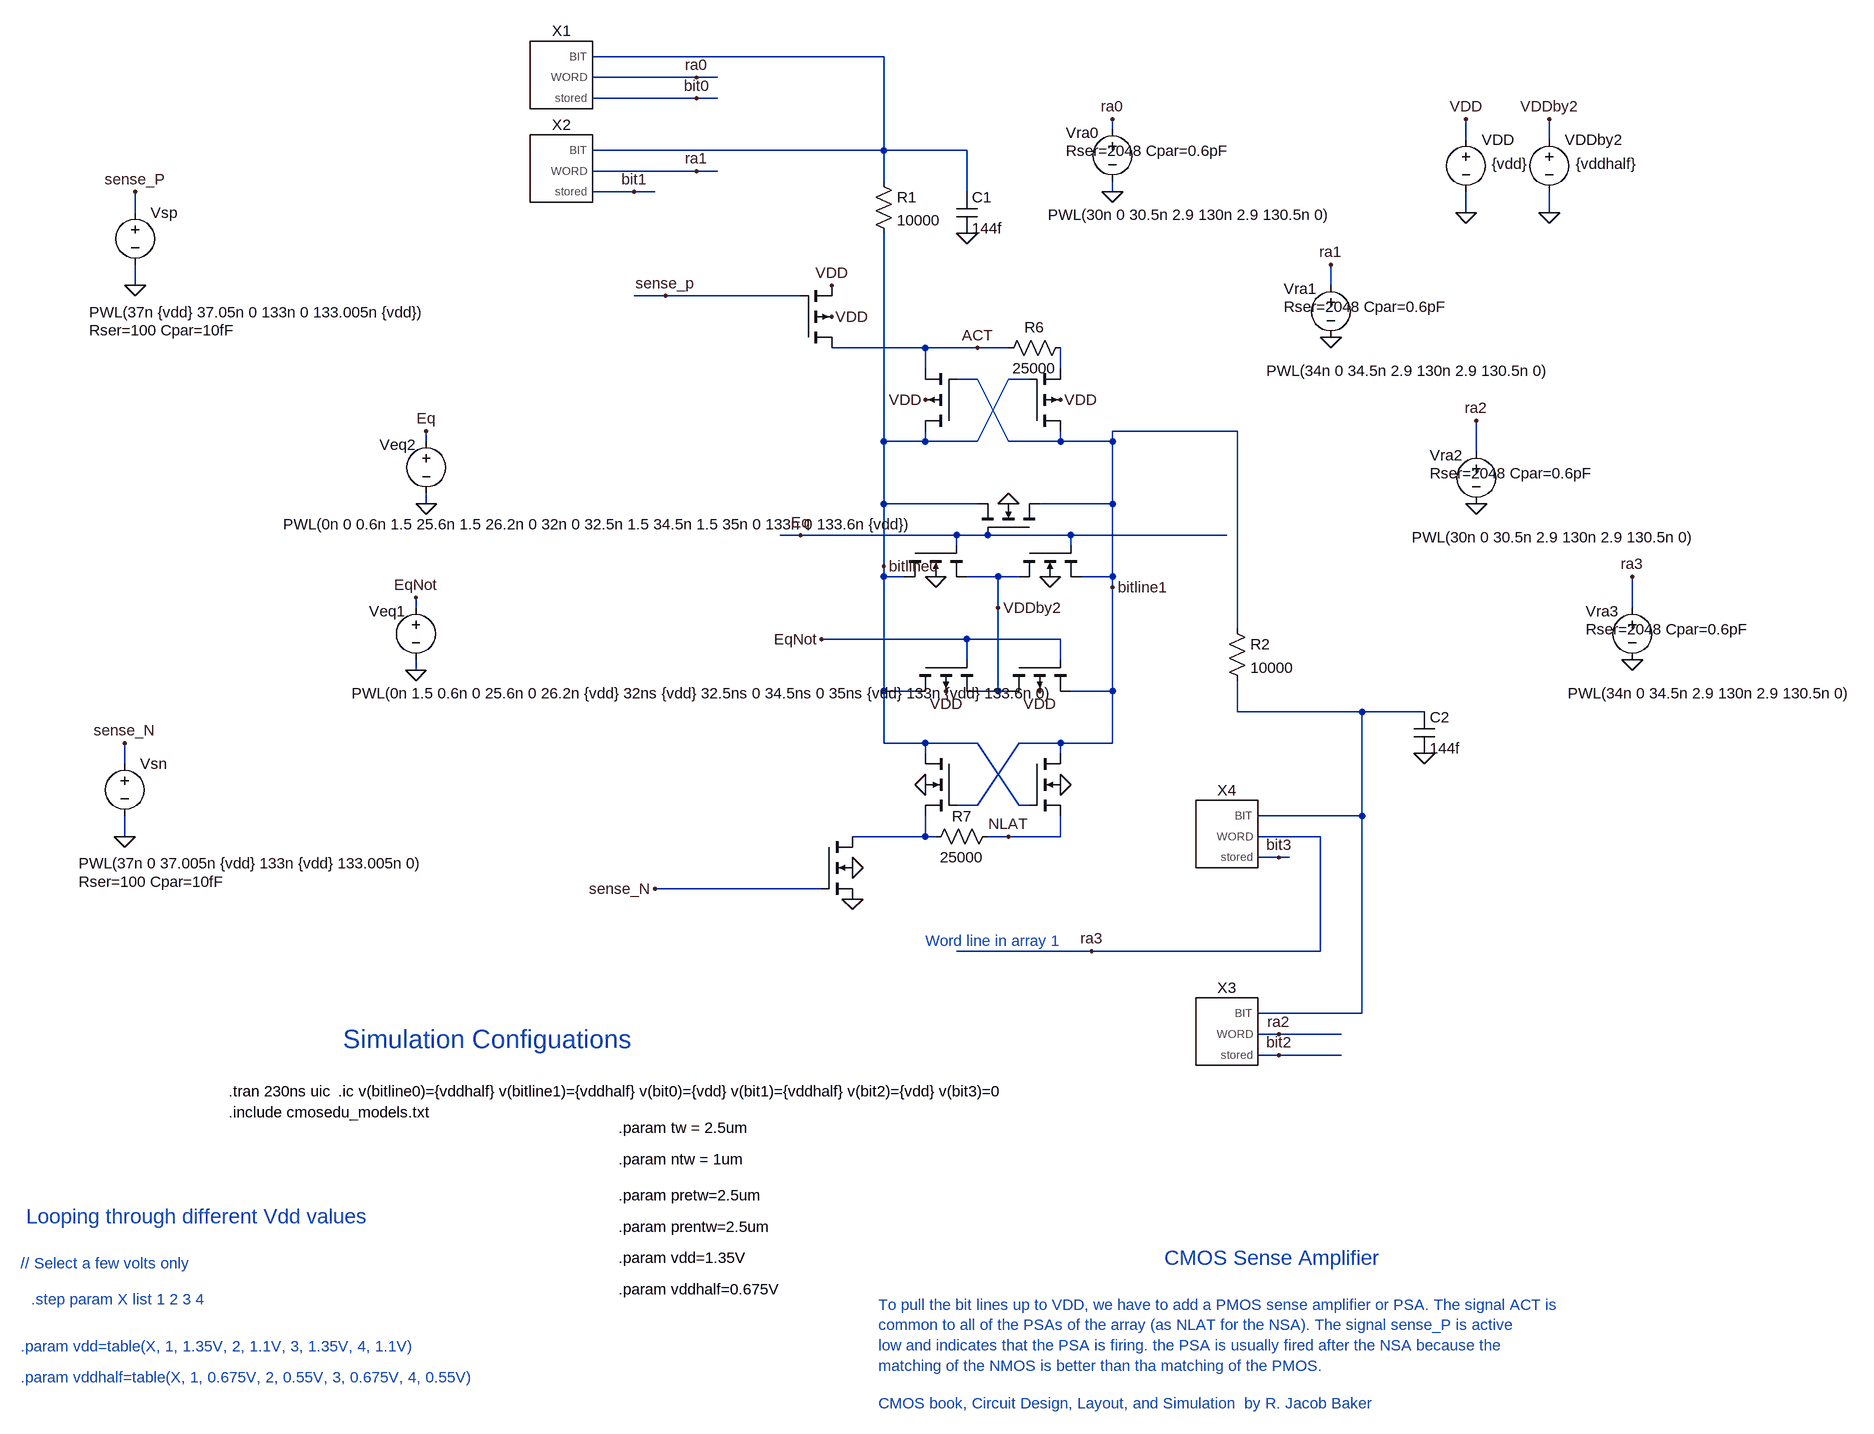
[diagram p0: schematic top_level.asc]
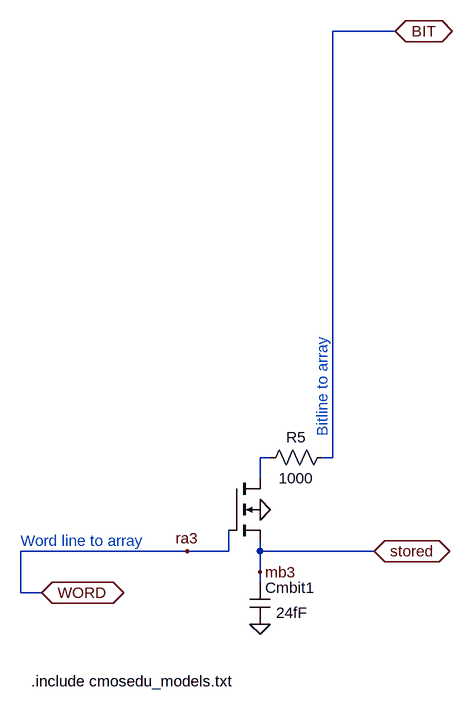
[diagram p1: sub-circuit dram_cell.asc]
top_level.asc, the LTspice schematic file:
Version 4
SHEET 1 2296 1352
WIRE 768 -1104 320 -1104
WIRE 480 -1072 320 -1072
WIRE 512 -1072 480 -1072
WIRE 480 -1040 320 -1040
WIRE 512 -1040 480 -1040
WIRE 1120 -992 1120 -1008
WIRE 1664 -976 1664 -1008
WIRE 1792 -976 1792 -1008
WIRE 768 -960 768 -1104
WIRE 768 -960 320 -960
WIRE 896 -960 768 -960
WIRE 480 -928 320 -928
WIRE 512 -928 480 -928
WIRE 768 -912 768 -960
WIRE 384 -896 320 -896
WIRE 416 -896 384 -896
WIRE 896 -896 896 -960
WIRE 1120 -896 1120 -912
WIRE -384 -864 -384 -896
WIRE 1664 -864 1664 -896
WIRE 1792 -864 1792 -896
WIRE -384 -752 -384 -784
WIRE 1456 -752 1456 -784
WIRE 432 -736 384 -736
WIRE 640 -736 432 -736
WIRE 832 -656 688 -656
WIRE 912 -656 832 -656
WIRE 960 -656 912 -656
WIRE 832 -624 832 -656
WIRE 1040 -624 1040 -656
WIRE 912 -608 880 -608
WIRE 992 -608 960 -608
WIRE 1312 -528 1120 -528
WIRE 64 -512 64 -528
WIRE 768 -512 768 -832
WIRE 832 -512 832 -528
WIRE 832 -512 768 -512
WIRE 912 -512 960 -608
WIRE 912 -512 832 -512
WIRE 960 -512 912 -608
WIRE 1040 -512 1040 -528
WIRE 1040 -512 960 -512
WIRE 1120 -512 1120 -528
WIRE 1120 -512 1040 -512
WIRE 1680 -496 1680 -544
WIRE 64 -416 64 -432
WIRE 768 -416 768 -512
WIRE 912 -416 768 -416
WIRE 1120 -416 1120 -512
WIRE 1120 -416 1008 -416
WIRE 640 -368 608 -368
WIRE 880 -368 640 -368
WIRE 928 -368 880 -368
WIRE 1056 -368 928 -368
WIRE 1296 -368 1056 -368
WIRE 880 -352 880 -368
WIRE 1056 -352 1056 -368
WIRE 768 -320 768 -416
WIRE 768 -304 768 -320
WIRE 800 -304 768 -304
WIRE 944 -304 896 -304
WIRE 976 -304 944 -304
WIRE 1120 -304 1120 -416
WIRE 1120 -304 1072 -304
WIRE 1120 -288 1120 -304
WIRE 48 -256 48 -272
WIRE 944 -256 944 -304
WIRE 1920 -256 1920 -304
WIRE 1312 -224 1312 -528
WIRE 896 -208 672 -208
WIRE 1040 -208 896 -208
WIRE 896 -176 896 -208
WIRE 1040 -176 1040 -208
WIRE 48 -160 48 -176
WIRE 768 -128 768 -304
WIRE 816 -128 768 -128
WIRE 944 -128 944 -256
WIRE 944 -128 912 -128
WIRE 960 -128 944 -128
WIRE 1120 -128 1120 -288
WIRE 1120 -128 1056 -128
WIRE 1312 -96 1312 -144
WIRE 1504 -96 1312 -96
WIRE 1600 -96 1504 -96
WIRE 768 -48 768 -128
WIRE 832 -48 768 -48
WIRE 912 -48 832 -48
WIRE 1040 -48 976 -48
WIRE 1120 -48 1120 -128
WIRE 1120 -48 1040 -48
WIRE 832 -32 832 -48
WIRE 1040 -32 1040 -48
WIRE -400 -16 -400 -48
WIRE 912 48 976 -48
WIRE 912 48 880 48
WIRE 976 48 912 -48
WIRE 992 48 976 48
WIRE 1504 64 1504 -96
WIRE 1504 64 1344 64
WIRE -400 96 -400 64
WIRE 832 96 832 64
WIRE 832 96 720 96
WIRE 848 96 832 96
WIRE 960 96 928 96
WIRE 1040 96 1040 64
WIRE 1040 96 960 96
WIRE 1440 96 1344 96
WIRE 1376 128 1344 128
WIRE 1392 128 1376 128
WIRE 672 176 416 176
WIRE 1088 272 880 272
WIRE 1440 272 1440 96
WIRE 1440 272 1088 272
WIRE 1504 368 1504 64
WIRE 1504 368 1344 368
WIRE 1376 400 1344 400
WIRE 1472 400 1376 400
WIRE 1376 432 1344 432
WIRE 1472 432 1376 432
FLAG 720 144 0
FLAG 1664 -864 0
FLAG 1664 -1008 VDD
FLAG 1792 -864 0
FLAG 1792 -1008 VDDby2
FLAG -384 -752 0
FLAG -384 -896 sense_P
FLAG 1040 16 0
FLAG 832 16 0
FLAG 960 -416 0
FLAG 848 -304 0
FLAG 1024 -304 0
FLAG 640 -368 Eq
FLAG 944 -256 VDDby2
FLAG 416 176 sense_N
FLAG 720 192 0
FLAG 768 -320 bitline0
FLAG 1120 -288 bitline1
FLAG 1088 272 ra3
FLAG 1120 -896 0
FLAG 1120 -1008 ra0
FLAG 688 -704 VDD
FLAG 1040 -576 VDD
FLAG 832 -576 VDD
FLAG 688 -752 VDD
FLAG 432 -736 sense_p
FLAG 912 -656 ACT
FLAG 960 96 NLAT
FLAG -400 96 0
FLAG -400 -48 sense_N
FLAG 672 -208 EqNot
FLAG 864 -128 VDD
FLAG 1008 -128 VDD
FLAG 48 -160 0
FLAG 48 -272 EqNot
FLAG 64 -416 0
FLAG 64 -528 Eq
FLAG 480 -1072 ra0
FLAG 480 -1040 bit0
FLAG 384 -896 bit1
FLAG 480 -928 ra1
FLAG 1376 400 ra2
FLAG 1376 432 bit2
FLAG 1376 128 bit3
FLAG 896 -832 0
FLAG 1600 -32 0
FLAG 1456 -784 ra1
FLAG 1456 -672 0
FLAG 1680 -416 0
FLAG 1920 -176 0
FLAG 1680 -544 ra2
FLAG 1920 -304 ra3
SYMBOL nmos4 672 96 R0
WINDOW 0 104 24 Invisible 2
WINDOW 3 179 41 Invisible 2
SYMATTR InstName M1
SYMATTR Value nmos45lp
SYMATTR Value2 l=0.27um w=0.22um
SYMBOL voltage 1664 -992 R0
WINDOW 123 0 0 Left 2
WINDOW 39 0 0 Left 2
WINDOW 3 40 53 Left 2
SYMATTR Value {vdd}
SYMATTR InstName VDD
SYMBOL voltage 1792 -992 R0
WINDOW 123 0 0 Left 2
WINDOW 39 0 0 Left 2
WINDOW 3 41 53 Left 2
SYMATTR Value {vddhalf}
SYMATTR InstName VDDby2
SYMBOL voltage -384 -880 R0
WINDOW 123 0 0 Left 2
WINDOW 39 -71 197 Left 2
WINDOW 3 -71 169 Left 2
SYMATTR SpiceLine Rser=100 Cpar=10fF
SYMATTR Value PWL(37n {vdd} 37.05n 0 133n 0 133.005n {vdd})
SYMATTR InstName Vsp
SYMBOL nmos4 992 -32 R0
WINDOW 0 104 24 Invisible 2
WINDOW 3 179 41 Invisible 2
SYMATTR InstName M2
SYMATTR Value nmos45hp
SYMATTR Value2 l=0.16um w={ntw}
SYMBOL nmos4 880 -32 M0
WINDOW 0 104 24 Invisible 2
WINDOW 3 179 41 Invisible 2
SYMATTR InstName M3
SYMATTR Value nmos45hp
SYMATTR Value2 l=0.16um w={ntw}
SYMBOL nmos4 1008 -368 M270
WINDOW 0 104 24 Invisible 2
WINDOW 3 179 41 Invisible 2
SYMATTR InstName M4
SYMATTR Value nmos45hp
SYMATTR Value2 l=0.16um w={prentw}
SYMBOL nmos4 800 -352 M90
WINDOW 0 104 24 Invisible 2
WINDOW 3 179 41 Invisible 2
SYMATTR InstName M5
SYMATTR Value nmos45hp
SYMATTR Value2 l=0.16um w={prentw}
SYMBOL nmos4 976 -352 M90
WINDOW 0 104 24 Invisible 2
WINDOW 3 179 41 Invisible 2
SYMATTR InstName M6
SYMATTR Value nmos45hp
SYMATTR Value2 l=0.16um w={prentw}
SYMBOL voltage 1120 -1008 R0
WINDOW 0 -72 21 Left 2
WINDOW 3 -99 147 Left 2
WINDOW 123 0 0 Left 2
WINDOW 39 -72 49 Left 2
SYMATTR InstName Vra0
SYMATTR Value PWL(30n 0 30.5n 2.9 130n 2.9 130.5n 0)
SYMATTR SpiceLine Rser=2048 Cpar=0.6pF
SYMBOL pmos4 640 -656 M180
WINDOW 0 56 32 Invisible 2
WINDOW 3 56 72 Invisible 2
SYMATTR InstName M9
SYMATTR Value pmos45lp
SYMATTR Value2 l=0.27um w=0.22um
SYMBOL pmos4 992 -528 M180
WINDOW 0 56 32 Invisible 2
WINDOW 3 56 72 Invisible 2
SYMATTR InstName M10
SYMATTR Value pmos45hp
SYMATTR Value2 l=0.16um w={tw}
SYMBOL pmos4 880 -528 R180
WINDOW 0 56 32 Invisible 2
WINDOW 3 56 72 Invisible 2
SYMATTR InstName M11
SYMATTR Value pmos45hp
SYMATTR Value2 l=0.16um w={tw}
SYMBOL voltage -400 -32 R0
WINDOW 123 0 0 Left 2
WINDOW 39 -71 197 Left 2
WINDOW 3 -71 169 Left 2
SYMATTR SpiceLine Rser=100 Cpar=10fF
SYMATTR Value PWL(37n 0 37.005n {vdd} 133n {vdd} 133.005n 0)
SYMATTR InstName Vsn
SYMBOL res 1056 -672 R90
WINDOW 0 0 56 VBottom 2
WINDOW 3 32 56 VTop 2
SYMATTR InstName R6
SYMATTR Value 25000
SYMBOL res 944 80 R90
WINDOW 0 0 56 VBottom 2
WINDOW 3 32 56 VTop 2
SYMATTR InstName R7
SYMATTR Value 25000
SYMBOL pmos4 816 -176 M90
WINDOW 0 56 32 Invisible 2
WINDOW 3 56 72 Invisible 2
SYMATTR InstName M12
SYMATTR Value pmos45hp
SYMATTR Value2 l=0.16um w={pretw}
SYMBOL pmos4 960 -176 M90
WINDOW 0 56 32 Invisible 2
WINDOW 3 56 72 Invisible 2
SYMATTR InstName M13
SYMATTR Value pmos45hp
SYMATTR Value2 l=0.16um w={pretw}
SYMBOL voltage 48 -272 R0
WINDOW 0 -72 21 Left 2
WINDOW 3 -99 147 Left 2
WINDOW 123 0 0 Left 2
WINDOW 39 0 0 Left 2
SYMATTR InstName Veq1
SYMATTR Value PWL(0n 1.5 0.6n 0 25.6n 0 26.2n {vdd} 32ns {vdd} 32.5ns 0 34.5ns 0 35ns {vdd} 133n {vdd} 133.6n 0)
SYMBOL voltage 64 -528 R0
WINDOW 0 -72 21 Left 2
WINDOW 3 -220 143 Left 2
WINDOW 123 0 0 Left 2
WINDOW 39 0 0 Left 2
SYMATTR InstName Veq2
SYMATTR Value PWL(0n 0 0.6n 1.5 25.6n 1.5 26.2n 0 32n 0 32.5n 1.5 34.5n 1.5 35n 0 133n 0 133.6n {vdd})
SYMBOL DRAM_cell 272 -1088 R0
SYMATTR InstName X1
SYMBOL DRAM_cell 1296 80 R0
SYMATTR InstName X4
SYMBOL DRAM_cell 272 -944 R0
SYMATTR InstName X2
SYMBOL DRAM_cell 1296 384 R0
SYMATTR InstName X3
SYMBOL res 752 -928 R0
SYMATTR InstName R1
SYMATTR Value 10000
SYMBOL cap 880 -896 R0
SYMATTR InstName C1
SYMATTR Value 144f
SYMBOL res 1296 -240 R0
SYMATTR InstName R2
SYMATTR Value 10000
SYMBOL cap 1584 -96 R0
SYMATTR InstName C2
SYMATTR Value 144f
SYMBOL voltage 1456 -768 R0
WINDOW 0 -72 21 Left 2
WINDOW 3 -99 147 Left 2
WINDOW 123 0 0 Left 2
WINDOW 39 -72 49 Left 2
SYMATTR InstName Vra1
SYMATTR Value PWL(34n 0 34.5n 2.9 130n 2.9 130.5n 0)
SYMATTR SpiceLine Rser=2048 Cpar=0.6pF
SYMBOL voltage 1680 -512 R0
WINDOW 0 -72 21 Left 2
WINDOW 3 -99 147 Left 2
WINDOW 123 0 0 Left 2
WINDOW 39 -72 49 Left 2
SYMATTR InstName Vra2
SYMATTR Value PWL(30n 0 30.5n 2.9 130n 2.9 130.5n 0)
SYMATTR SpiceLine Rser=2048 Cpar=0.6pF
SYMBOL voltage 1920 -272 R0
WINDOW 0 -72 21 Left 2
WINDOW 3 -99 147 Left 2
WINDOW 123 0 0 Left 2
WINDOW 39 -72 49 Left 2
SYMATTR InstName Vra3
SYMATTR Value PWL(34n 0 34.5n 2.9 130n 2.9 130.5n 0)
SYMATTR SpiceLine Rser=2048 Cpar=0.6pF
TEXT -240 520 Left 2 !.include cmosedu_models.txt
TEXT -72 488 Left 2 !.ic v(bitline0)={vddhalf} v(bitline1)={vddhalf} v(bit0)={vdd} v(bit1)={vddhalf} v(bit2)={vdd} v(bit3)=0
TEXT -240 488 Left 2 !.tran 230ns uic
TEXT 832 256 Left 2 ;Word line in array 1
TEXT 1200 744 Left 3 ;CMOS Sense Amplifier
TEXT 760 816 Left 2 ;To pull the bit lines up to VDD, we have to add a PMOS sense amplifier or PSA. The signal ACT is\ncommon to all of the PSAs of the array (as NLAT for the NSA). The signal sense_P is active\nlow and indicates that the PSA is firing. the PSA is usually fired after the NSA because the \nmatching of the NMOS is better than tha matching of the PMOS.
TEXT 760 968 Left 2 ;CMOS book, Circuit Design, Layout, and Simulation  by R. Jacob Baker
TEXT -64 408 Left 4 ;Simulation Configuations
TEXT -552 680 Left 3 ;Looping through different Vdd values
TEXT -544 808 Left 2 ;.step param X list 1 2 3 4
TEXT -560 752 Left 2 ;// Select a few volts only
TEXT -560 880 Left 2 ;.param vdd=table(X, 1, 1.35V, 2, 1.1V, 3, 1.35V, 4, 1.1V)
TEXT -560 928 Left 2 ;.param vddhalf=table(X, 1, 0.675V, 2, 0.55V, 3, 0.675V, 4, 0.55V)
TEXT 360 544 Left 2 !.param tw = 2.5um
TEXT 360 592 Left 2 !.param ntw = 1um
TEXT 360 648 Left 2 !.param pretw=2.5um
TEXT 360 696 Left 2 !.param prentw=2.5um
TEXT 360 744 Left 2 !.param vdd=1.35V
TEXT 360 792 Left 2 !.param vddhalf=0.675V

dram_cell.asc, the sub-circuit schematic file:
Version 4
SHEET 1 1952 1352
WIRE 1408 -528 1312 -528
WIRE 1216 128 1200 128
WIRE 1312 128 1312 -528
WIRE 1312 128 1296 128
WIRE 1200 160 1200 128
WIRE 1088 272 832 272
WIRE 1152 272 1152 240
WIRE 1152 272 1088 272
WIRE 1200 272 1200 256
WIRE 1376 272 1200 272
WIRE 1200 304 1200 272
WIRE 1200 320 1200 304
WIRE 832 336 832 272
WIRE 864 336 832 336
FLAG 1200 208 0
FLAG 1200 384 0
FLAG 1200 304 mb3
FLAG 1088 272 ra3
FLAG 1408 -528 BIT
IOPIN 1408 -528 BiDir
FLAG 864 336 WORD
IOPIN 864 336 BiDir
FLAG 1376 272 stored
IOPIN 1376 272 BiDir
SYMBOL nmos4 1152 160 R0
WINDOW 0 104 24 Invisible 2
WINDOW 3 179 41 Invisible 2
SYMATTR InstName M8
SYMATTR Value nmos45lp
SYMATTR Value2 l=0.085um w=0.055um
SYMBOL cap 1184 320 R0
WINDOW 3 41 47 Left 2
SYMATTR Value 24fF
SYMATTR InstName Cmbit1
SYMBOL res 1312 112 R90
WINDOW 0 0 56 VBottom 2
WINDOW 3 32 56 VTop 2
SYMATTR InstName R5
SYMATTR Value 1000
TEXT 1296 96 VLeft 2 ;Bitline to array
TEXT 832 256 Left 2 ;Word line to array
TEXT 848 472 Left 2 !.include cmosedu_models.txt

The netlist it stands for:
* top_level.asc
M1 N004 sense_N 0 0 nmos45lp l=0.27um w=0.22um
VDD VDD 0 {vdd}
VDDby2 VDDby2 0 {vddhalf}
Vsp sense_P 0 PWL(37n {vdd} 37.05n 0 133n 0 133.005n {vdd}) Rser=100 Cpar=10fF
M2 bitline1 bitline0 NLAT 0 nmos45hp l=0.16um w={ntw}
M3 bitline0 bitline1 N004 0 nmos45hp l=0.16um w={ntw}
M4 bitline1 Eq bitline0 0 nmos45hp l=0.16um w={prentw}
M5 bitline0 Eq VDDby2 0 nmos45hp l=0.16um w={prentw}
M6 VDDby2 Eq bitline1 0 nmos45hp l=0.16um w={prentw}
Vra0 ra0 0 PWL(30n 0 30.5n 2.9 130n 2.9 130.5n 0) Rser=2048 Cpar=0.6pF
M9 ACT sense_P VDD VDD pmos45lp l=0.27um w=0.22um
M10 bitline1 bitline0 N002 VDD pmos45hp l=0.16um w={tw}
M11 bitline0 bitline1 ACT VDD pmos45hp l=0.16um w={tw}
Vsn sense_N 0 PWL(37n 0 37.005n {vdd} 133n {vdd} 133.005n 0) Rser=100 Cpar=10fF
R6 N002 ACT 25000
R7 NLAT N004 25000
M12 bitline0 EqNot VDDby2 VDD pmos45hp l=0.16um w={pretw}
M13 VDDby2 EqNot bitline1 VDD pmos45hp l=0.16um w={pretw}
Veq1 EqNot 0 PWL(0n 1.5 0.6n 0 25.6n 0 26.2n {vdd} 32ns {vdd} 32.5ns 0 34.5ns 0 35ns {vdd} 133n {vdd} 133.6n 0)
Veq2 Eq 0 PWL(0n 0 0.6n 1.5 25.6n 1.5 26.2n 0 32n 0 32.5n 1.5 34.5n 1.5 35n 0 133n 0 133.6n {vdd})
XX1 N001 ra0 bit0 dram_cell
XX4 N003 ra3 bit3 dram_cell
XX2 N001 ra1 bit1 dram_cell
XX3 N003 ra2 bit2 dram_cell
R1 N001 bitline0 10000
C1 N001 0 144f
R2 bitline1 N003 10000
C2 N003 0 144f
Vra1 ra1 0 PWL(34n 0 34.5n 2.9 130n 2.9 130.5n 0) Rser=2048 Cpar=0.6pF
Vra2 ra2 0 PWL(30n 0 30.5n 2.9 130n 2.9 130.5n 0) Rser=2048 Cpar=0.6pF
Vra3 ra3 0 PWL(34n 0 34.5n 2.9 130n 2.9 130.5n 0) Rser=2048 Cpar=0.6pF

* block symbol definitions
.subckt dram_cell BIT WORD stored
M8 N001 WORD stored 0 nmos45lp l=0.085um w=0.055um
Cmbit1 stored 0 24fF
R5 BIT N001 1000
* Bitline to array
* Word line to array
.include cmosedu_models.txt
.ends dram_cell

.model NMOS NMOS
.model PMOS PMOS
.lib standard.mos
.include cmosedu_models.txt
.ic v(bitline0)={vddhalf} v(bitline1)={vddhalf} v(bit0)={vdd} v(bit1)={vddhalf} v(bit2)={vdd} v(bit3)=0
.tran 230ns uic
* Word line in array 1
* CMOS Sense Amplifier
* To pull the bit lines up to VDD, we have to add a PMOS sense amplifier or PSA. The signal ACT is
* common to all of the PSAs of the array (as NLAT for the NSA). The signal sense_P is active
* low and indicates that the PSA is firing. the PSA is usually fired after the NSA because the
* matching of the NMOS is better than tha matching of the PMOS.
* CMOS book, Circuit Design, Layout, and Simulation  by R. Jacob Baker
* Simulation Configuations
* Looping through different Vdd values
* .step param X list 1 2 3 4
* // Select a few volts only
* .param vdd=table(X, 1, 1.35V, 2, 1.1V, 3, 1.35V, 4, 1.1V)
* .param vddhalf=table(X, 1, 0.675V, 2, 0.55V, 3, 0.675V, 4, 0.55V)
.param tw = 2.5um
.param ntw = 1um
.param pretw=2.5um
.param prentw=2.5um
.param vdd=1.35V
.param vddhalf=0.675V
.backanno
.end

* Results of the author's LTspice run, read from the files saved beside the schematic
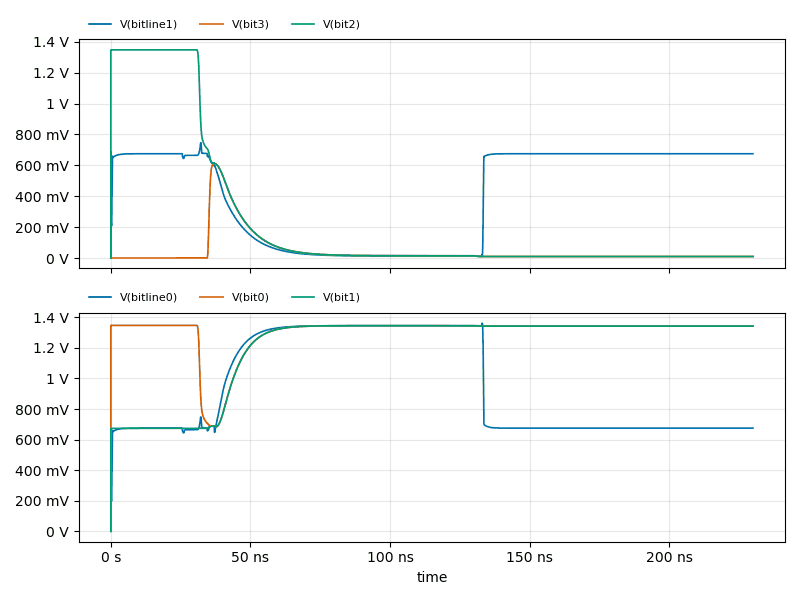
[diagram p2: Transient Analysis of top_level.asc, plotted from the saved traces]
* Transient Analysis, 1 run:
*   V(bitline1): min 0 V, max 746.2 mV, average 418.2 mV, rms 519.7 mV, last 675 mV
*   V(bit3): min 0 V, max 611.3 mV, average 42.75 mV, rms 114.6 mV, last 9.868 mV
*   V(bit2): min 0 V, max 1.348 V, average 240.4 mV, rms 522.3 mV, last 9.868 mV
*   V(bitline0): min 0 V, max 1.362 V, average 936.5 mV, rms 989.5 mV, last 675 mV
*   V(bit0): min 0 V, max 1.348 V, average 1.305 V, rms 1.312 V, last 1.342 V
*   V(bit1): min 0 V, max 1.345 V, average 1.211 V, rms 1.238 V, last 1.342 V